# Altium schematic sheet Input_1.SchDoc
size A4
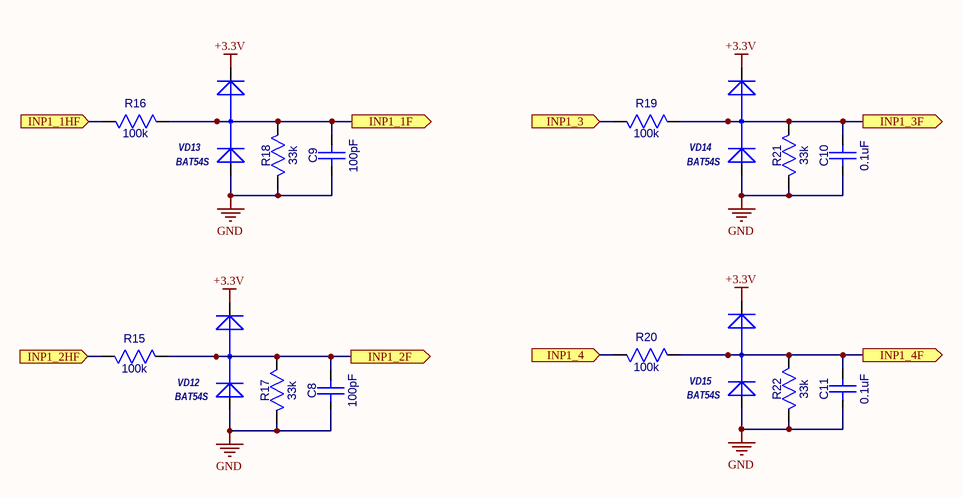
[diagram p0: Input_1.SchDoc]

## Parts
C8  100pF  [CC0603-3M]
C9  100pF  [CC0603-3M]
C10  0.1uF  [CC0603-3M]
C11  0.1uF  [CC0603-3M]
R15  100k  [RC0603-3M]
R16  100k  [RC0603-3M]
R17  33k  [RC0603-3M]
R18  33k  [RC0603-3M]
R19  100k  [RC0603-3M]
R20  100k  [RC0603-3M]
R21  33k  [RC0603-3M]
R22  33k  [RC0603-3M]
VD12  BAT54S  [SOT-23(GSD)]
VD13  BAT54S  [SOT-23(GSD)]
VD14  BAT54S  [SOT-23(GSD)]
VD15  BAT54S  [SOT-23(GSD)]

## Ports
INP1_1F (out), INP1_1HF (in), INP1_2F (out), INP1_2HF (in), INP1_3 (in), INP1_3F (out), INP1_4 (in), INP1_4F (out)

## Nets
+3.3V: VD12.2(K) VD13.2(K) VD14.2(K) VD15.2(K)
GND: C8.1(A) C9.1(A) C10.1(A) C11.1(A) R17.2(B) R18.2(B) R21.2(B) R22.2(B) VD12.1(A) VD13.1(A) VD14.1(A) VD15.1(A)
INP1_1F: C9.2(B) R16.1(A) R18.1(A) VD13.3(AK) ; port INP1_1F
INP1_1HF: R16.2(B) ; port INP1_1HF
INP1_2F: C8.2(B) R15.1(A) R17.1(A) VD12.3(AK) ; port INP1_2F
INP1_2HF: R15.2(B) ; port INP1_2HF
INP1_3: R19.2(B) ; port INP1_3
INP1_3F: C10.2(B) R19.1(A) R21.1(A) VD14.3(AK) ; port INP1_3F
INP1_4: R20.2(B) ; port INP1_4
INP1_4F: C11.2(B) R20.1(A) R22.1(A) VD15.3(AK) ; port INP1_4F

## Library data of the parts
C8-C11 = CC0603
  C8 C9: Value: 100pF
  C10 C11: Value: 0.1uF
R15-R22 = RC0603
  R15 R16 R19 R20: Value: 100k
  R17 R18 R21 R22: Value: 33k
VD12-VD15 = BAT54S: ComponentField6: Published 8-Jun-2000, Modified 11-July-2000: SIM Model Added.; Value: *